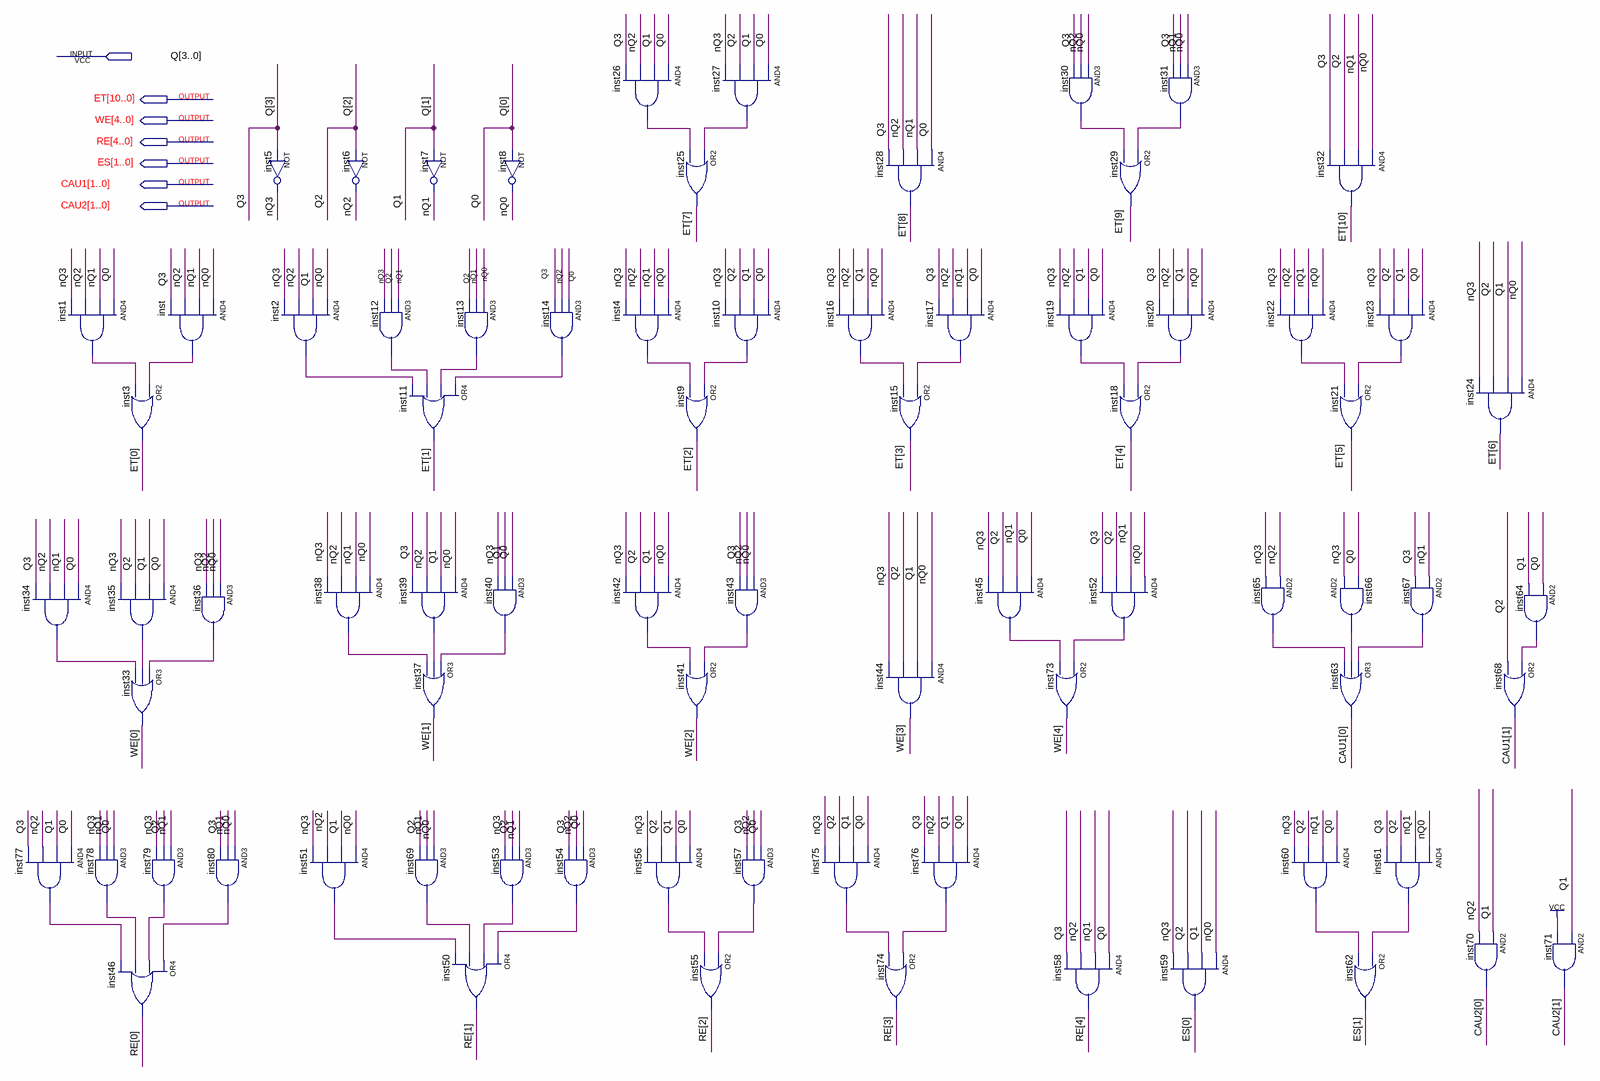
[diagram p0: schematic sheet]
// Quartus schematic OUTPUT_FUNCT.bdf as structural Verilog: 77 symbols, 7 pins
module OUTPUT_FUNCT (
  input  [3:0] Q,
  output [10:0] ET,
  output [4:0] WE,
  output [4:0] RE,
  output [1:0] ES,
  output [1:0] CAU1,
  output [1:0] CAU2
);

  wire inst1_out, inst2_out, inst4_out, inst10_out, inst12_out, inst13_out, inst14_out, inst16_out,
       inst17_out, inst19_out, inst20_out, inst22_out, inst23_out, inst26_out, inst27_out, inst30_out,
       inst31_out, inst34_out, inst35_out, inst36_out, inst38_out, inst39_out, inst40_out, inst42_out,
       inst43_out, inst45_out, inst51_out, inst52_out, inst53_out, inst54_out, inst56_out, inst57_out,
       inst60_out, inst61_out, inst64_out, inst65_out, inst66_out, inst67_out, inst69_out, inst75_out,
       inst76_out, inst77_out, inst78_out, inst79_out, inst80_out, inst_out, nQ0, nQ1, nQ2, nQ3;

  and inst1 (inst1_out, Q[0], nQ1, nQ2, nQ3);
  and inst34 (inst34_out, Q[0], nQ1, nQ2, Q[3]);
  and inst77 (inst77_out, Q[0], Q[1], nQ2, Q[3]);
  and inst35 (inst35_out, Q[0], Q[1], Q[2], nQ3);
  and inst78 (inst78_out, Q[0], nQ1, nQ3);
  or inst46 (RE[0], inst80_out, inst79_out, inst78_out, inst77_out);
  and inst (inst_out, nQ0, nQ1, nQ2, Q[3]);
  or inst3 (ET[0], inst_out, inst1_out);
  or inst33 (WE[0], inst36_out, inst35_out, inst34_out);
  and inst79 (inst79_out, nQ1, Q[2], nQ3);
  and inst36 (inst36_out, nQ0, nQ2, nQ3);
  and inst80 (inst80_out, nQ0, nQ1, Q[3]);
  not inst5 (nQ3, Q[3]);
  and inst2 (inst2_out, nQ0, Q[1], nQ2, nQ3);
  not inst6 (nQ2, Q[2]);
  and inst38 (inst38_out, nQ0, nQ1, nQ2, nQ3);
  and inst51 (inst51_out, nQ0, Q[1], nQ2, nQ3);
  and inst12 (inst12_out, nQ1, Q[2], nQ3);
  or inst11 (ET[1], inst14_out, inst13_out, inst12_out, inst2_out);
  and inst39 (inst39_out, nQ0, Q[1], nQ2, Q[3]);
  not inst7 (nQ1, Q[1]);
  and inst13 (inst13_out, nQ0, nQ1, Q[2]);
  or inst37 (WE[1], inst40_out, inst39_out, inst38_out);
  and inst69 (inst69_out, nQ0, nQ1, Q[2]);
  or inst50 (RE[1], inst54_out, inst53_out, inst69_out, inst51_out);
  not inst8 (nQ0, Q[0]);
  and inst40 (inst40_out, Q[0], Q[1], nQ3);
  and inst53 (inst53_out, nQ1, Q[2], nQ3);
  and inst14 (inst14_out, Q[0], nQ2, Q[3]);
  and inst54 (inst54_out, Q[0], nQ2, Q[3]);
  and inst26 (inst26_out, Q[0], Q[1], nQ2, Q[3]);
  and inst4 (inst4_out, nQ0, nQ1, nQ2, nQ3);
  and inst42 (inst42_out, nQ0, Q[1], Q[2], nQ3);
  or inst25 (ET[7], inst27_out, inst26_out);
  or inst9 (ET[2], inst10_out, inst4_out);
  or inst41 (WE[2], inst43_out, inst42_out);
  and inst56 (inst56_out, Q[0], Q[1], Q[2], nQ3);
  and inst27 (inst27_out, Q[0], Q[1], Q[2], nQ3);
  and inst10 (inst10_out, Q[0], Q[1], Q[2], nQ3);
  and inst43 (inst43_out, nQ0, nQ2, Q[3]);
  and inst57 (inst57_out, Q[0], nQ2, Q[3]);
  or inst55 (RE[2], inst57_out, inst56_out);
  and inst16 (inst16_out, nQ0, Q[1], nQ2, nQ3);
  and inst75 (inst75_out, Q[0], Q[1], Q[2], nQ3);
  and inst28 (ET[8], Q[0], nQ1, nQ2, Q[3]);
  or inst15 (ET[3], inst17_out, inst16_out);
  and inst44 (WE[3], nQ0, Q[1], Q[2], nQ3);
  and inst76 (inst76_out, Q[0], Q[1], nQ2, Q[3]);
  or inst74 (RE[3], inst76_out, inst75_out);
  and inst17 (inst17_out, Q[0], nQ1, nQ2, Q[3]);
  and inst45 (inst45_out, Q[0], nQ1, Q[2], nQ3);
  and inst30 (inst30_out, nQ0, nQ2, Q[3]);
  and inst19 (inst19_out, Q[0], Q[1], nQ2, nQ3);
  or inst73 (WE[4], inst52_out, inst45_out);
  and inst58 (RE[4], Q[0], nQ1, nQ2, Q[3]);
  or inst29 (ET[9], inst31_out, inst30_out);
  or inst18 (ET[4], inst20_out, inst19_out);
  and inst52 (inst52_out, nQ0, nQ1, Q[2], Q[3]);
  and inst31 (inst31_out, nQ0, nQ1, Q[3]);
  and inst20 (inst20_out, nQ0, Q[1], nQ2, Q[3]);
  and inst59 (ES[0], nQ0, Q[1], Q[2], nQ3);
  and inst65 (inst65_out, nQ2, nQ3);
  and inst22 (inst22_out, nQ0, nQ1, nQ2, nQ3);
  and inst60 (inst60_out, Q[0], nQ1, Q[2], nQ3);
  and inst32 (ET[10], nQ0, nQ1, Q[2], Q[3]);
  and inst23 (inst23_out, Q[0], Q[1], Q[2], nQ3);
  or inst21 (ET[5], inst23_out, inst22_out);
  and inst66 (inst66_out, nQ3, Q[0]);
  or inst63 (CAU1[0], inst67_out, inst66_out, inst65_out);
  or inst62 (ES[1], inst61_out, inst60_out);
  and inst67 (inst67_out, nQ1, Q[3]);
  and inst61 (inst61_out, nQ0, nQ1, Q[2], Q[3]);
  and inst24 (ET[6], nQ0, Q[1], Q[2], nQ3);
  and inst70 (CAU2[0], Q[1], nQ2);
  and inst64 (inst64_out, Q[0], Q[1]);
  or inst68 (CAU1[1], inst64_out, Q[2]);
  and inst71 (CAU2[1], Q[1], 1'b1);
endmodule
